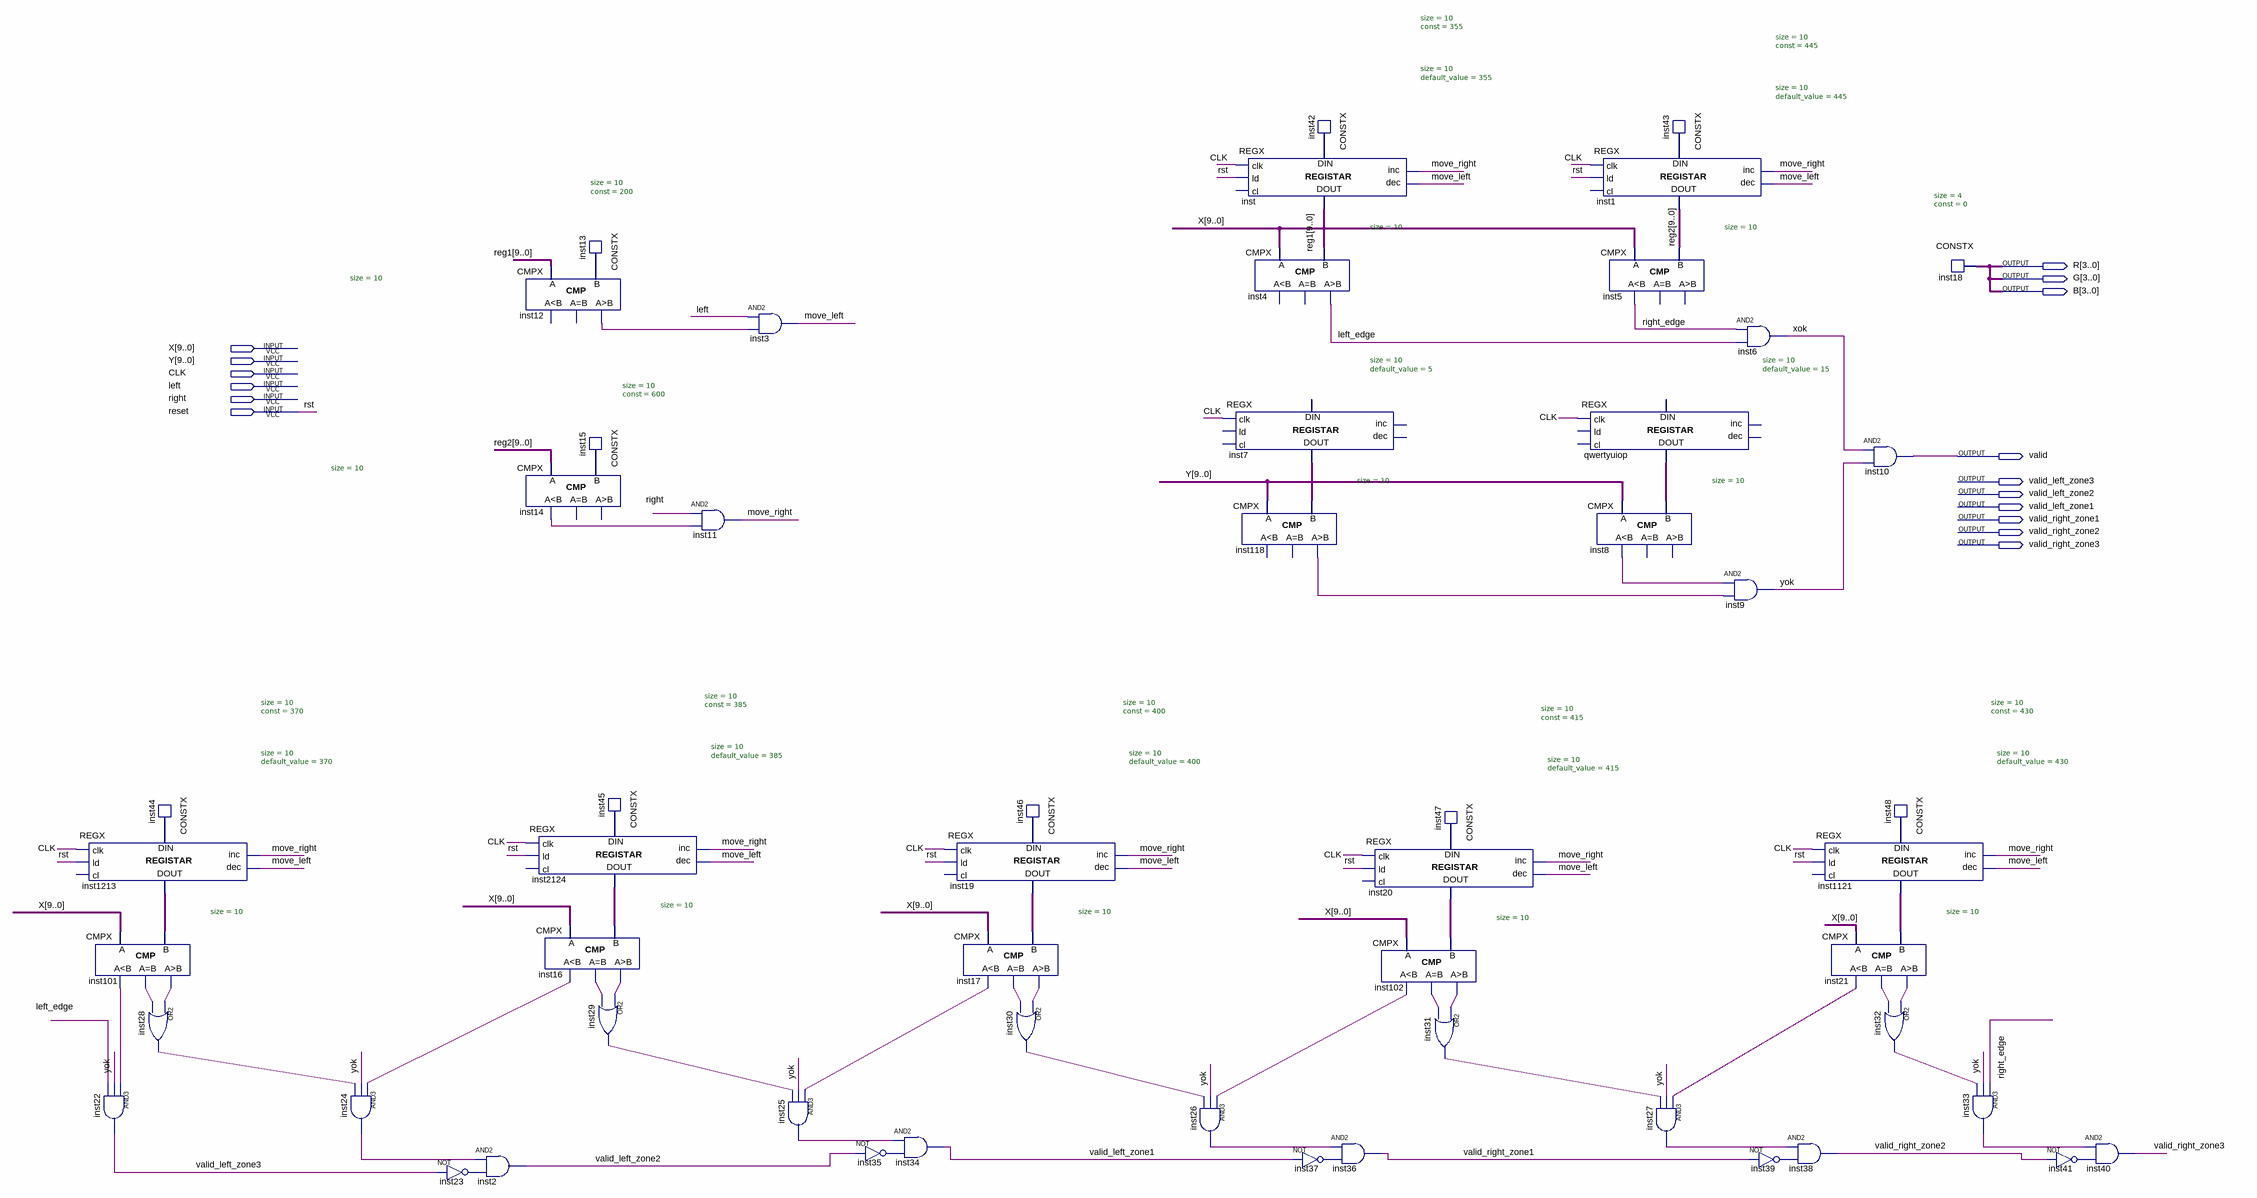
[diagram p0: schematic sheet]
// Quartus schematic paddle1.bdf as structural Verilog: 56 symbols, 16 pins
module paddle1 (
  input  [9:0] X,
  input  [9:0] Y,
  input  CLK,
  input  left,
  input  right,
  input  reset,
  output [3:0] R,
  output [3:0] G,
  output [3:0] B,
  output valid,
  output valid_left_zone3,
  output valid_left_zone2,
  output valid_left_zone1,
  output valid_right_zone1,
  output valid_right_zone2,
  output valid_right_zone3
);

  wire inst8_ls, inst12_gr, inst14_ls, inst16_eq, inst16_gr, inst16_ls, inst17_eq, inst17_gr, inst17_ls,
       inst21_eq, inst21_gr, inst21_ls, inst23_out, inst24_out, inst25_out, inst26_out, inst27_out,
       inst28_out, inst29_out, inst30_out, inst31_out, inst32_out, inst33_out, inst35_out, inst37_out,
       inst39_out, inst41_out, inst101_eq, inst101_gr, inst101_ls, inst102_eq, inst102_gr, inst102_ls,
       inst118_gr, left_edge, move_left, move_right, right_edge, xok, yok;
  wire [9:0] inst7_data_out, inst13_data, inst15_data, inst19_data_out, inst20_data_out, inst42_data,
       inst43_data, inst44_data, inst45_data, inst46_data, inst47_data, inst48_data, inst1121_data_out,
       inst1213_data_out, inst2124_data_out, qwertyuiop_data_out, reg1, reg2;

  REGX #(.size(10), .default_value(370)) inst1213 (
    .clk(CLK), .ld(reset), .inc(move_right), .dec(move_left), .data_in(inst44_data),
    .data_out(inst1213_data_out));  // open: cl
  CMPX #(.size(10)) inst101 (.A(X), .B(inst1213_data_out), .ls(inst101_ls), .eq(inst101_eq), .gr(inst101_gr));
  and inst22 (valid_left_zone3, inst101_ls, yok, left_edge);
  CONSTX #(.size(10), .\const (370)) inst44 (.data(inst44_data));
  or inst28 (inst28_out, inst101_gr, inst101_eq);
  and inst24 (inst24_out, inst16_ls, yok, inst28_out);
  not inst23 (inst23_out, valid_left_zone3);
  and inst2 (valid_left_zone2, inst24_out, inst23_out);
  CMPX #(.size(10)) inst12 (.A(reg1), .B(inst13_data), .gr(inst12_gr));  // open: ls, eq
  CMPX #(.size(10)) inst14 (.A(reg2), .B(inst15_data), .ls(inst14_ls));  // open: eq, gr
  REGX #(.size(10), .default_value(385)) inst2124 (
    .clk(CLK), .ld(reset), .inc(move_right), .dec(move_left), .data_in(inst45_data),
    .data_out(inst2124_data_out));  // open: cl
  CMPX #(.size(10)) inst16 (.A(X), .B(inst2124_data_out), .ls(inst16_ls), .eq(inst16_eq), .gr(inst16_gr));
  CONSTX #(.size(10), .\const (200)) inst13 (.data(inst13_data));
  CONSTX #(.size(10), .\const (600)) inst15 (.data(inst15_data));
  CONSTX #(.size(10), .\const (385)) inst45 (.data(inst45_data));
  or inst29 (inst29_out, inst16_gr, inst16_eq);
  and inst11 (move_right, right, inst14_ls);
  and inst3 (move_left, left, inst12_gr);
  and inst25 (inst25_out, inst17_ls, yok, inst29_out);
  not inst35 (inst35_out, valid_left_zone2);
  and inst34 (valid_left_zone1, inst25_out, inst35_out);
  REGX #(.size(10), .default_value(400)) inst19 (
    .clk(CLK), .ld(reset), .inc(move_right), .dec(move_left), .data_in(inst46_data),
    .data_out(inst19_data_out));  // open: cl
  CMPX #(.size(10)) inst17 (.A(X), .B(inst19_data_out), .ls(inst17_ls), .eq(inst17_eq), .gr(inst17_gr));
  or inst30 (inst30_out, inst17_gr, inst17_eq);
  CONSTX #(.size(10), .\const (400)) inst46 (.data(inst46_data));
  and inst26 (inst26_out, inst102_ls, yok, inst30_out);
  REGX #(.size(10), .default_value(355)) inst (
    .clk(CLK), .ld(reset), .inc(move_right), .dec(move_left), .data_in(inst42_data), .data_out(reg1));  // open: cl
  CMPX #(.size(10)) inst4 (.A(X), .B(reg1), .gr(left_edge));  // open: ls, eq
  REGX #(.size(10), .default_value(5)) inst7 (.clk(CLK), .data_out(inst7_data_out));  // open: ld, cl, inc, dec, data_in
  CMPX #(.size(10)) inst118 (.A(Y), .B(inst7_data_out), .gr(inst118_gr));  // open: ls, eq
  CONSTX #(.size(10), .\const (355)) inst42 (.data(inst42_data));
  not inst37 (inst37_out, valid_left_zone1);
  REGX #(.size(10), .default_value(415)) inst20 (
    .clk(CLK), .ld(reset), .inc(move_right), .dec(move_left), .data_in(inst47_data),
    .data_out(inst20_data_out));  // open: cl
  and inst36 (valid_right_zone1, inst26_out, inst37_out);
  CMPX #(.size(10)) inst102 (.A(X), .B(inst20_data_out), .ls(inst102_ls), .eq(inst102_eq), .gr(inst102_gr));
  CONSTX #(.size(10), .\const (415)) inst47 (.data(inst47_data));
  or inst31 (inst31_out, inst102_gr, inst102_eq);
  REGX #(.size(10), .default_value(445)) inst1 (
    .clk(CLK), .ld(reset), .inc(move_right), .dec(move_left), .data_in(inst43_data), .data_out(reg2));  // open: cl
  CMPX #(.size(10)) inst5 (.A(X), .B(reg2), .ls(right_edge));  // open: eq, gr
  REGX #(.size(10), .default_value(15)) qwertyuiop (
    .clk(CLK), .data_out(qwertyuiop_data_out));  // open: ld, cl, inc, dec, data_in
  CMPX #(.size(10)) inst8 (.A(Y), .B(qwertyuiop_data_out), .ls(inst8_ls));  // open: eq, gr
  CONSTX #(.size(10), .\const (445)) inst43 (.data(inst43_data));
  and inst27 (inst27_out, inst21_ls, yok, inst31_out);
  and inst6 (xok, right_edge, left_edge);
  and inst9 (yok, inst8_ls, inst118_gr);
  not inst39 (inst39_out, valid_right_zone1);
  REGX #(.size(10), .default_value(430)) inst1121 (
    .clk(CLK), .ld(reset), .inc(move_right), .dec(move_left), .data_in(inst48_data),
    .data_out(inst1121_data_out));  // open: cl
  CMPX #(.size(10)) inst21 (.A(X), .B(inst1121_data_out), .ls(inst21_ls), .eq(inst21_eq), .gr(inst21_gr));
  and inst38 (valid_right_zone2, inst27_out, inst39_out);
  and inst10 (valid, xok, yok);
  CONSTX #(.size(10), .\const (430)) inst48 (.data(inst48_data));
  or inst32 (inst32_out, inst21_gr, inst21_eq);
  CONSTX #(.size(4), .\const (0)) inst18 (.data(B));
  and inst33 (inst33_out, right_edge, yok, inst32_out);
  not inst41 (inst41_out, valid_right_zone2);
  and inst40 (valid_right_zone3, inst33_out, inst41_out);

  assign G = B;
  assign R = B;

  // Other names for the same wires on the sheet: rst = reset
endmodule
